# Altium schematic sheet ESP32 Relay Card Power.SchDoc
size A3; SheetNumber: 1; SheetTotal: 2
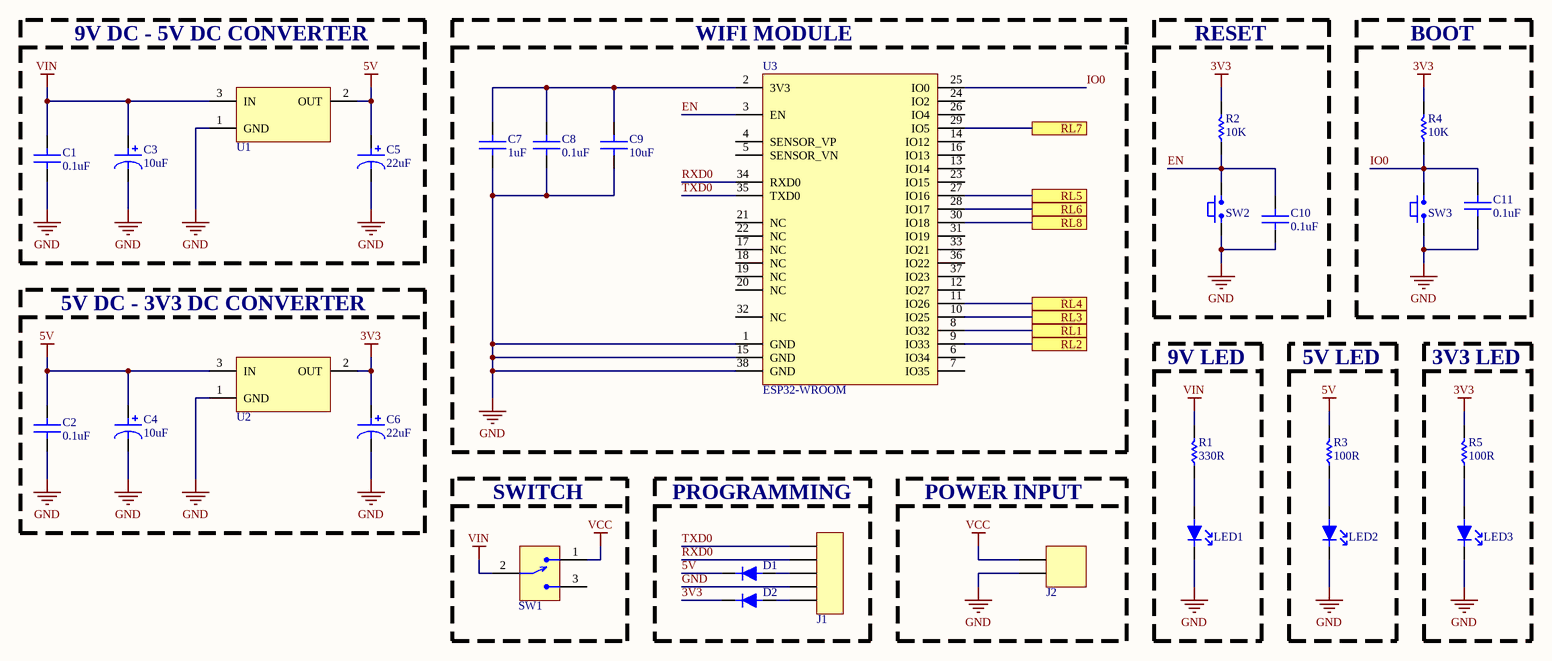
[diagram p0: ESP32 Relay Card Power.SchDoc]

## Parts
C1  value 0.1uF  [CAP 0805]  (hidden comment: CC0805KRX7R9BB104)
C2  value 0.1uF  [CAP 0805]  (hidden comment: CC0805KRX7R9BB104)
C3  value 10uF  [CAP ALUM 10UF]  (hidden comment: 875105359001)
C4  value 10uF  [CAP ALUM 10UF]  (hidden comment: 875105359001)
C5  value 22uF  [CAP ALUM 22UF]  (hidden comment: A766EB226M1DLAE060)
C6  value 22uF  [CAP ALUM 22UF]  (hidden comment: A766EB226M1DLAE060)
C7  value 1uF  [CAP 0805]  (hidden comment: CC0805KKX7R9BB105)
C8  value 0.1uF  [CAP 0805]  (hidden comment: CC0805KRX7R9BB104)
C9  value 10uF  [CAP 0805]  (hidden comment: CC0805KKX5R8BB106)
C10  value 0.1uF  [CAP 0805]  (hidden comment: CC0805KRX7R9BB104)
C11  value 0.1uF  [CAP 0805]  (hidden comment: CC0805KRX7R9BB104)
D1  1N5819W  [SOD-123F]  (value not drawn)
D2  1N5819W  [SOD-123F]  (value not drawn)
J1  61300511121  [HEADER]  (value not drawn)
J2  TB006-508-02BE  [2POS CONNECTOR]  (value not drawn)
LED1  150080VS75000  [LED 0805 SMD]  (value not drawn)
LED2  150080VS75000  [LED 0805 SMD]  (value not drawn)
LED3  150080VS75000  [LED 0805 SMD]  (value not drawn)
R1  value 330R  [RES 0603]  (hidden comment: CRGH0603F330R)
R2  value 10K  [RES 0603]  (hidden comment: CRGH0603J10K)
R3  value 100R  [RES 0603]  (hidden comment: CRGH0603J100R)
R4  value 10K  [RES 0603]  (hidden comment: CRGH0603J10K)
R5  value 100R  [RES 0603]  (hidden comment: CRGH0603J100R)
SW1  500SSP1S2M2QEA  [TACTICLE SWITCH TH]  (value not drawn)
SW2  PTS636SM43SMTR LFS  [TACTICLE SWITCH]  (value not drawn)
SW3  PTS636SM43SMTR LFS  [TACTICLE SWITCH]  (value not drawn)
U1  AMS1117-5.0  [SOT223]  (value not drawn)
U2  AMS1117-3.3  [SOT223]  (value not drawn)
U3  value ESP32-WROOM  [ESP32]  (hidden comment: ESP32-WROOM-32E-H4)

## Blocks framed on the sheet
9V DC - 5V DC CONVERTER: C1 C3 C5 U1
WIFI MODULE: C7-C9 U3
RESET: C10 R2 SW2
BOOT: C11 R4 SW3
5V DC - 3V3 DC CONVERTER: C2 C4 C6 U2
9V LED: LED1 R1
5V LED: LED2 R3
3V3 LED: LED3 R5
SWITCH: SW1
PROGRAMMING: D1 D2 J1
POWER INPUT: J2

## Ports
RL1 (see ESP32 Relay Card Relay[1A]), RL2 (see ESP32 Relay Card Relay[1B]), RL3 (see ESP32 Relay Card Relay[1C]), RL4 (see ESP32 Relay Card Relay[3A]), RL5 (see ESP32 Relay Card Relay[3B]), RL6 (see ESP32 Relay Card Relay[3C]), RL7 (see ESP32 Relay Card Relay[5A]), RL8 (see ESP32 Relay Card Relay[5B])

## Nets
3V3: C6.1 D2.2 R2.2 R4.2 R5.2 U2.2(OUT)
5V: C2.2 C4.1 C5.1 D1.2 R3.2 U1.2(OUT) U2.3(IN)
GND: C1.1 C2.1 C3.2 C4.2 C5.2 C6.2 C7.1 C8.1 C9.1 C10.1 C11.1 J1.4 J2.2 LED1.2 LED2.2 LED3.2 SW2.1 SW3.1 U1.1(GND) U2.1(GND) U3.1(GND) U3.15(GND) U3.38(GND)
VCC: J2.1 SW1.1
VIN: C1.2 C3.1 R1.2 SW1.2 U1.3(IN)
EN: C10.2 R2.1 SW2.2 U3.3(EN)
IO0: C11.2 R4.1 SW3.2 U3.25(IO0)
RL1: U3.8(IO32) ; port RL1
RL2: U3.9(IO33) ; port RL2
RL3: U3.10(IO25) ; port RL3
RL4: U3.11(IO26) ; port RL4
RL5: U3.27(IO16) ; port RL5
RL6: U3.28(IO17) ; port RL6
RL7: U3.29(IO5) ; port RL7
RL8: U3.30(IO18) ; port RL8
RXD0: J1.2 U3.34(RXD0)
TXD0: J1.1 U3.35(TXD0)
NetC7_2: C7.2 C8.2 C9.2 U3.2(3V3)
NetD1_1: D1.1 J1.3
NetD2_1: D2.1 J1.5
NetLED1_1: LED1.1 R1.1
NetLED2_1: LED2.1 R3.1
NetLED3_1: LED3.1 R5.1

Not connected (* = marked no-connect by the designer): SW1 3; U3 4(SENSOR_VP) 5(SENSOR_VN) 6(IO34) 7(IO35) 12(IO27) 13(IO14) 14(IO12) 16(IO13) 17(NC) 18(NC) 19(NC) 20(NC) 21(NC) 22(NC) 23(IO15) 24(IO2) 26(IO4) 31(IO19) 32(NC) 33(IO21) 36(IO22) 37(IO23)

## Notes on the sheet
- Dosya Adı / File Name
- Hazırlayan / Prepared By
- Tanım / Description
- Değiştirme Tarihi / Changed Date
- Bölüm / Department
- Onaylayan / Approved By
- Kontrol Eden / Checked By
- Boyut / Size
- Sayfa / Sheet
- Revizyon / Revision

## Library data of the parts
C1 C2 C8 C10 C11 = CAP CER 0.1UF 0805 SMD: CAP CER 0.1UF 50V X7R 0805
C3 C4 = CAP ALUM 10UF SMD: CAP ALUM 10UF 20% 16V SMD
C5 C6 = CAP ALUM 22UF SMD: CAP ALUM 22UF 20% 20V SMD
C7 = CAP CER 1UF 0805 SMD: CAP CER 1UF 50V X7R 0805
C9 = CAP CER 10UF 0805 SMD: CAP CER 10UF 25V X5R 0805
D1 D2 = SCHOTTKY DIODE SMD: DIODE SCHOTTKY 40V 1A SOD-123F
J1 = HEADER 5POS TH: CONN HEADER 5POS 2.54MM
J2 = 2POS CONNECTOR: TERM BLK 2P 5.08 PCB
LED1-LED3 = GREEN LED 0805 SMD: LED GREEN 0805 SMD
R1 = RES 330 OHM 0603 SMD: RES 330 OHM 1% 1/5W 0603
R2 R4 = RES 10K OHM 0603 SMD: RES 10K OHM 5% 1/5W 0603
R3 R5 = RES 100 OHM 0603 SMD: RES 100 OHM 5% 1/5W 0603
SW1 = SLIDE SWITCH TH: SWITCH SLIDE 5A 120V
SW2 SW3 = TACTILE SWITCH SMD: SWITCH TACTILE 0.05A 12V
U1 = LDO REG 5V 1A SMD: IC LDO REG 5V 1A SOT223
U2 = LDO REG 3V3 1A SMD: IC LDO REG 3.3V 1A SOT223
U3 = ESP32-WROOM-32E: RF TXRX MOD BT WIFI TH SMD